# Altium schematic sheet module.SchDoc
size 400 x 287 mm; SheetNumber: 1; SheetTotal: 1; sch_doc_type: Schematic Diagram; sch_lang: en; sch_doc_status: Draft
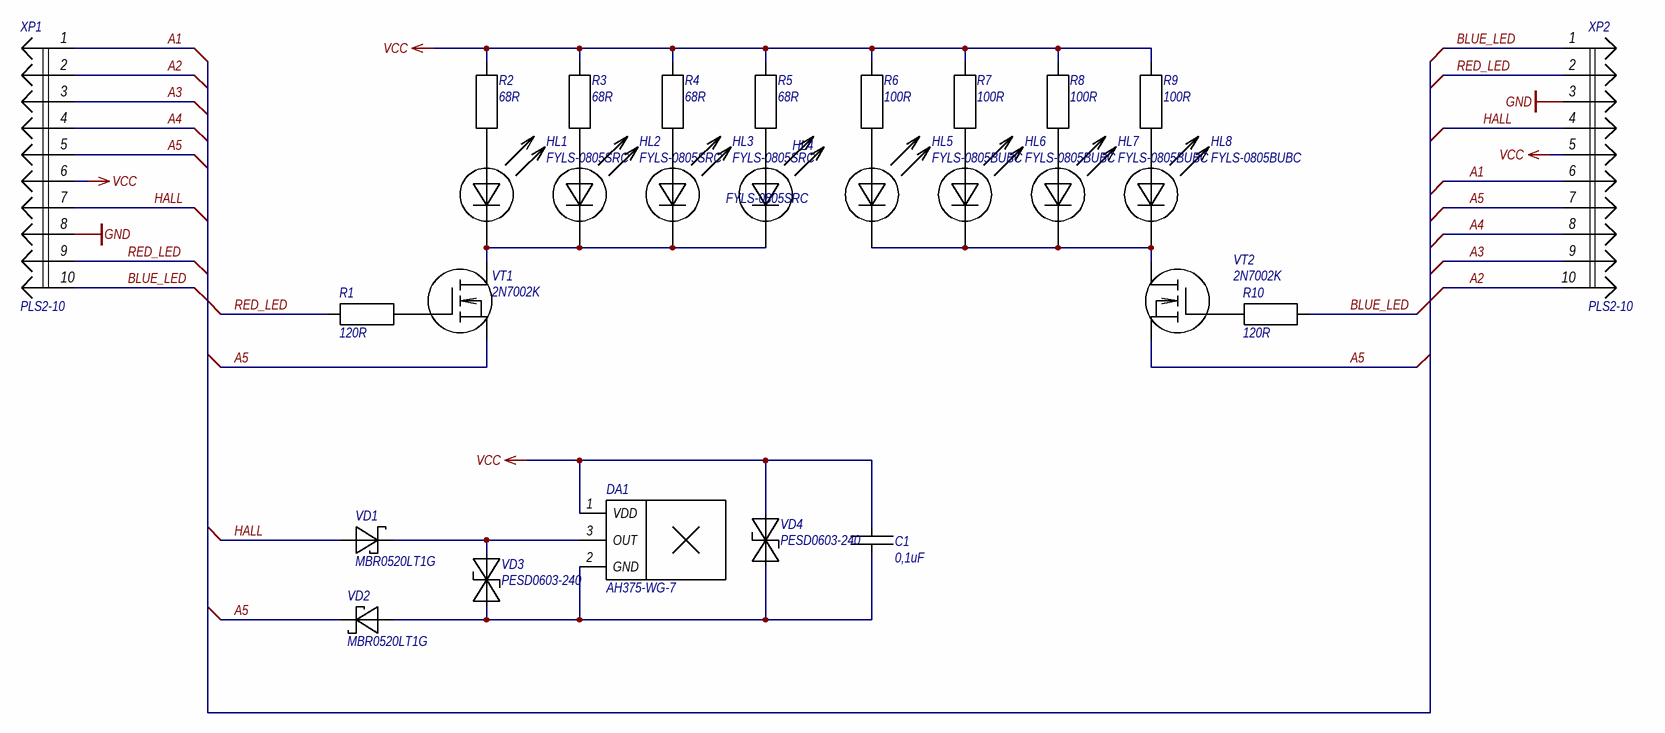
[diagram p0: module.SchDoc]

## Parts
C1  0,1uF  [C0805C]
DA1  AH375-WG-7  [SOT23-3(1-3-2)]
HL1  FYLS-0805SRC  [LED0805]
HL2  FYLS-0805SRC  [LED0805]
HL3  FYLS-0805SRC  [LED0805]
HL4  FYLS-0805SRC  [LED0805]
HL5  FYLS-0805BUBC  [LED0805]
HL6  FYLS-0805BUBC  [LED0805]
HL7  FYLS-0805BUBC  [LED0805]
HL8  FYLS-0805BUBC  [LED0805]
R1  120R  [C0603R]
R2  68R  [C0805R]
R3  68R  [C0805R]
R4  68R  [C0805R]
R5  68R  [C0805R]
R6  100R  [C0805R]
R7  100R  [C0805R]
R8  100R  [C0805R]
R9  100R  [C0805R]
R10  120R  [C0603R]
VD1  MBR0520LT1G  [SOD123]
VD2  MBR0520LT1G  [SOD123]
VD3  PESD0603-240  [C0603D]
VD4  PESD0603-240  [C0603D]
VT1  2N7002K  [SOT23-3-FET]
VT2  2N7002K  [SOT23-3-FET]
XP1  PLS2-10  [PLS2-10]
XP2  PLS2-10  [PLS2-10]

## Nets
GND: XP1.8 XP2.3
VCC: C1.1 DA1.1(VDD) R2.1 R3.1 R4.1 R5.1 R6.1 R7.1 R8.1 R9.1 VD4.C XP1.6 XP2.5
A1: XP1.1 XP2.6
A2: XP1.2 XP2.10
A3: XP1.3 XP2.9
A4: XP1.4 XP2.8
A5: VD2.C VT1.S VT2.S XP1.5 XP2.7
BLUE_LED: R10.1 XP1.10 XP2.1
HALL: VD1.A XP1.7 XP2.4
RED_LED: R1.1 XP1.9 XP2.2
NetC1_2: C1.2 DA1.2(GND) VD2.A VD3.A VD4.A
NetDA1_3: DA1.3(OUT) VD1.C VD3.C
NetHL1_1: HL1.1(A) R2.2
NetHL1_2: HL1.2(C) HL2.2(C) HL3.2(C) HL4.2(C) VT1.D
NetHL2_1: HL2.1(A) R3.2
NetHL3_1: HL3.1(A) R4.2
NetHL4_1: HL4.1(A) R5.2
NetHL5_1: HL5.1(A) R6.2
NetHL5_2: HL5.2(C) HL6.2(C) HL7.2(C) HL8.2(C) VT2.D
NetHL6_1: HL6.1(A) R7.2
NetHL7_1: HL7.1(A) R8.2
NetHL8_1: HL8.1(A) R9.2
NetR1_2: R1.2 VT1.G
NetR10_2: R10.2 VT2.G

## Notes on the sheet
- Responsible dept.
- Technical reference
- Created by
- Approved by
- Document type
- Document status
- Title
- Rev.
- Date of issue
- Lang.
- Sheet
- A3

## Library data of the parts
C1 = CC0805KKX7R0BB104: CC0805KKX7R0BB104, 0805 X7R  0,1 uF 100V; Manufacturer: Yageo; Value: 0,1; Tolerance: ±10%; Tmin: -55; Tmax: 125; Part Number: CC0805KKX7R0BB104; Footprint Patch: rescap.PcbLib; Package: SMD 0805; Units: uF; Dielectric: X7R; Voltage: 100V; ComponentLink1Description: Datasheet
DA1 = AH375-WG-7: SINGLE PHASE HALL EFFECT LATCH; Manufacturer: Diodes Incorporated; Tmin: -40; Tmax: 125; Part Number: AH375-WG-7; Footprint Patch: ic.PcbLib; Package: SOT23-3; Type: HALL SENS; ComponentLink1Description: Datasheet; ComponentLink1URL: https://www.diodes.com/assets/Datasheets/AH375.pdf
HL1-HL4 = FYLS-0805SRC: SMD 0805 Red 20mA 15mcd; Manufacturer: Foryard; Voltage: 1,7V; Part Number: FYLS-0805SRC; Footprint Patch: optic.pcblib; Package: SMD 0805; Color: Red; Current: 20mA; Luminous intensity: 15mcd; ComponentLink1Description: Datasheet
HL5-HL8 = FYLS-0805BUBC: SMD 0805 Blue 20mA 120mcd; Manufacturer: Foryard; Voltage: 3.2V; Part Number: FYLS-0805BUBC; Footprint Patch: optic.pcblib; Package: SMD 0805; Color: Blue; Current: 20mA; Luminous intensity: 120mcd; ComponentLink1Description: Datasheet; ComponentLink1URL: https://sds.compel.ru/item-pdf/af57fc3221a5baec3bd2f6bc6f3289b6/ps/foryard~fyls-0805bubc.pdf
R1 R10 = RC0603FR-07120RL: RC0603FR-07120RL, 1% 120R; Manufacturer: Yageo; ppm: 100; Power: 0,1; Voltage: 75; Part Number: RC0603FR-07120RL; Footprint Patch: rescap.PcbLib; Package: SMD 0603; Value: 120R; Tolerance: 1%
R2-R5 = RC0805FR-0768RL: RC0805FR-0768RL, 1% 68R; Manufacturer: Yageo; ppm: 100; Power: 0,125; Voltage: 150; Part Number: RC0805FR-0768RL; Footprint Patch: rescap.PcbLib; Package: SMD 0805; Value: 68R; Tolerance: 1%
R6-R9 = RC0805FR-07100RL: RC0805FR-07100RL, 1% 100R; Manufacturer: Yageo; ppm: 100; Power: 0,125; Voltage: 150; Part Number: RC0805FR-07100RL; Footprint Patch: rescap.PcbLib; Package: SMD 0805; Value: 100R; Tolerance: 1%
VD1 VD2 = MBR0520LT1G: MBR0520LT1G, SOD123 V A, V; Part Number: MBR0520LT1G; Footprint Patch: diode.PcbLib; Package: SOD123; ComponentLink1Description: Datasheet; ComponentLink1URL: *
VD3 VD4 = PESD0603-240: PESD0603-240, SMD 0603 24V   BI-directional; Manufacturer: Littelfuse, Inc; Voltage: 24; Cap: 0,25pF; Tmin: -55; Tmax: 125; Part Number: PESD0603-240; Footprint Patch: diode.PcbLib; Package: SMD 0603; Direction: BI-directional; ComponentLink1Description: Datasheet; ComponentLink1URL: https://m.littelfuse.com/~/media/electronics/product_specifications/polymer_esd_suppressors/littelfuse_polymer_esd_suppressor_pesd0603_240_product_specification.pdf.pdf
VT1 VT2 = 2N7002K: 2N7002K, SOT23-3 0,3A 60V; Manufacturer: ON semiconductor; Type: N; I Drain: 0,3; U Gate th: 1; U Gate max: 20; U Drain-Source: 60; Input Cap: 50; RDS: 2; Qg: 0,1 nC; P: 350mW; Part Number: 2N7002K; Footprint Patch: transistor.PcbLib; Package: SOT23-3; ComponentLink1Description: Datasheet; ComponentLink1URL: https://www.onsemi.com/pub/Collateral/2N7002K-D.PDF
XP1 XP2 = PLS2-10: PLS2-10, ,  10 Pins; System: Connector; Part Number: PLS2-10; Footprint Patch: connector.PcbLib; Pins: 10; ComponentLink1Description: Datasheet